# Altium schematic sheet Sch_BuckXL6009.SchDoc
size A
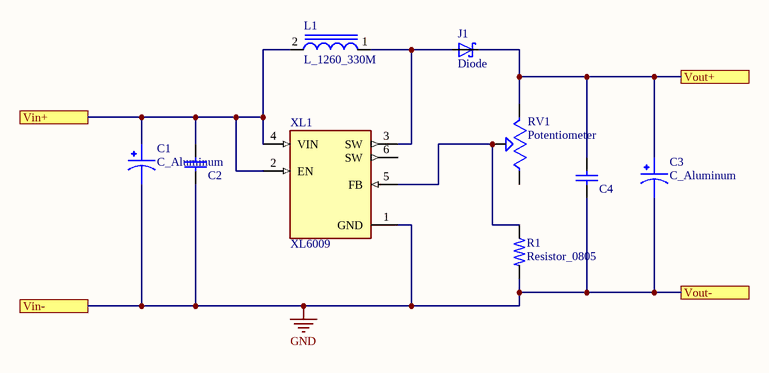
[diagram p0: Sch_BuckXL6009.SchDoc]

## Parts
C1  C_Aluminum  [C_Aluminum]
C2  Capacitor Ceramic  [CAP_0805]  (value not drawn)
C3  C_Aluminum  [C_Aluminum]
C4  Capacitor Ceramic  [CAP_0805]  (value not drawn)
J1  Diode  [Diode(Wr)]
L1  L_1260_330M  [L_1260_330M]
R1  Resistor_0805  [Resistor_0805]
RV1  Potentiometer  [Potentiometer_ThroughHole]
XL1  XL6009  [XL6009]

## Ports
Vin+, Vin-, Vout+, Vout-

## Nets
GND: C1.2 C2.1 C3.2 C4.1 R1.2 XL1.1(GND) ; port Vin-, port Vout-
Vin+: C1.1 C2.2 L1.2 XL1.2(EN) XL1.4(VIN) ; port Vin+
Vout+: C3.1 C4.2 J1.C RV1.3 ; port Vout+
NetJ1_A: J1.A L1.1 XL1.3(SW)
NetR1_1: R1.1 RV1.2 XL1.5(FB)

Not connected (* = marked no-connect by the designer): RV1 1; XL1 6(SW)

## Library data of the parts
C1 C3 = C_Aluminum: 220ÂµF 50V Aluminum Electrolytic Capacitors Radial, Can - SMD 1000 Hrs @ 105Â°C; MF: Nichicon; MP: UWT1H221MNL1GS; Package: Radial Nichicon; Price: None; Availability: Unavailable; SnapEDA_Link: https://www.snapeda.com/parts/UWT1H221MNL1GS/Nichicon/view-part/566503/?ref=snap; Value: *
C2 C4 = Capacitor SMD: Capacitor; Value: 33p; Published: 8-Jun-2000; LatestRevisionDate: 17-Jul-2002; LatestRevisionNote: Re-released for DXP Platform.; PackageReference: RAD-0.3; Publisher: Altium Limited
J1 = Diode: Diode; Repetitive Reverse Voltage Max, Vrrm: 40V; Forward Current, If(AV): 3A; Forward Surge Current Max, Ifsm: 100A;...; MP: SS34; MF: ON Semiconductor; Package: SMC-2 ON Semiconductor; Availability: Good; Price: None; Purchase-URL: https://pricing.snapeda.com/search/part/SS34/?ref=eda; Check_prices: https://www.snapeda.com/parts/SS34/ON%20Semiconductor/view-part/547583/?ref=eda; SnapEDA_Link: https://www.snapeda.com/parts/SS34/ON%20Semiconductor/view-part/547583/?ref=snap; Value: *
L1 = L_1260_330M: 33ÂµH Shielded Wirewound Inductor 3A 60mOhm Max Nonstandard; MF: Bourns; MP: SRR1260-330M; Price: None; Package: Nonstandard Bourns; Value: *; SnapEDA_Link: https://www.snapeda.com/parts/SRR1260-330M/Bourns/view-part/378985/?ref=snap; Availability: Unavailable
R1 = Resistor_0805: CRG0805 1% 24K; MP: 1623163-1; Package: None; Price: None; Value: *; Availability: Unavailable
RV1 = Potentiometer_ThroughHole: 25 kOhms 0.5W, 1/2W PC Pins Through Hole Trimmer Potentiometer Cermet 25 Turn Top Adjustment; MF: Bourns; MP: PV36W253C01B00; Value: *; Availability: Bad; SnapEDA_Link: https://www.snapeda.com/parts/PV36W253C01B00/Bourns/view-part/1448352/?ref=snap; Mouser-Purchase-URL: https://snapeda.com/shop?store=Mouser&id=1448352; Package: 6332 Bourns; DigiKey-Purchase-URL: https://snapeda.com/shop?store=DigiKey&id=1448352; Price: None
XL1 = XL6009: The XL6009 regulator is a wide input range, current mode, DC/DC converter which is capable of generating either positive or negative output voltages.; MF: XLSEMI; MP: XL6009; Price: None; Availability: Unavailable; Package: Package Analog Devices; SnapEDA_Link: https://www.snapeda.com/parts/XL6009/XLSEMI/view-part/2888428/?ref=snap; Value: *